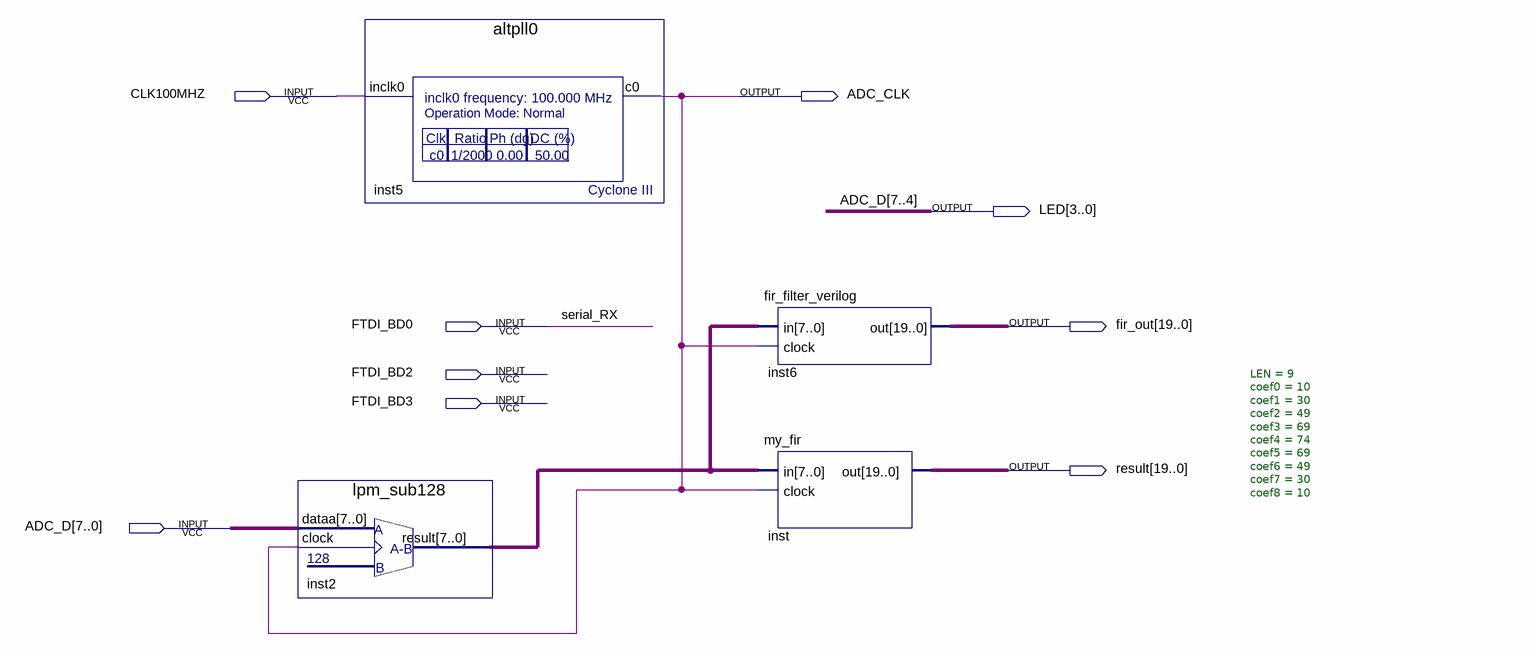
[diagram p0: schematic sheet]
// Quartus schematic cyclone3.bdf as structural Verilog: 4 symbols, 9 pins
module cyclone3 (
  input  CLK100MHZ,
  input  FTDI_BD0,
  input  FTDI_BD2,
  input  FTDI_BD3,
  input  [7:0] ADC_D,
  output ADC_CLK,
  output [3:0] LED,
  output [19:0] fir_out,
  output [19:0] result
);

  wire [7:0] inst2_result;

  lpm_sub128 inst2 (.dataa(ADC_D), .clock(ADC_CLK), .result(inst2_result));
  altpll0 inst5 (.inclk0(CLK100MHZ), .c0(ADC_CLK));
  fir_filter_verilog #(.LEN(9), .coef0(10), .coef1(30), .coef2(49), .coef3(69), .coef4(74), .coef5(69), .coef6(49), .coef7(30), .coef8(10)) inst6 (
    .in(inst2_result), .clock(ADC_CLK), .out(fir_out));
  my_fir inst (.in(inst2_result), .clock(ADC_CLK), .out(result));

  assign LED = ADC_D[7:4];

  // Other names for the same wires on the sheet: serial_RX = FTDI_BD0
endmodule
